# Altium schematic sheet DRV5032AJLPGM.SchDoc
size A; SheetNumber: 13; SheetTotal: 20
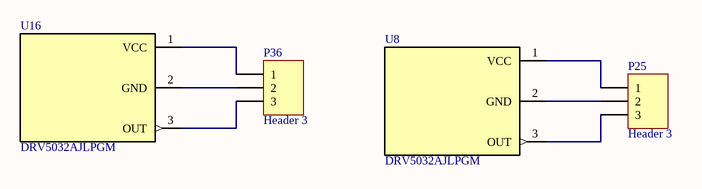
[diagram p0: DRV5032AJLPGM.SchDoc]

## Parts
P25  Header 3  [HDR1X3]
P36  Header 3  [HDR1X3]
U8  DRV5032AJLPGM  [SENSOR_DRV5055A2QLPGM]
U16  DRV5032AJLPGM  [SENSOR_DRV5055A2QLPGM]

## Nets
NetP25_1: P25.1 U8.1(VCC)
NetP25_2: P25.2 U8.2(GND)
NetP25_3: P25.3 U8.3(OUT)
NetP36_1: P36.1 U16.1(VCC)
NetP36_2: P36.2 U16.2(GND)
NetP36_3: P36.3 U16.3(OUT)

## Library data of the parts
P25 P36 = Header 3: Header, 3-Pin; LatestRevisionDate: 17-Jul-2002; LatestRevisionNote: Re-released for DXP Platform.; Publisher: Altium Limited
U8 U16 = DRV5032AJLPGM: Low power (5 Hz, <1ÂµA), low voltage (up to 5.5V) switch; MF: Texas Instruments; Value: *; MP: DRV5032AJLPGM; Package: TO-92-3 Texas Instruments; Check_prices: https://www.snapeda.com/parts/DRV5032AJLPGM/Texas+Instruments/view-part/?ref=eda; Purchase-URL: https://pricing.snapeda.com/search/part/DRV5032AJLPGM/?ref=eda; Price: None; Availability: In Stock; SnapEDA_Link: https://www.snapeda.com/parts/DRV5032AJLPGM/Texas+Instruments/view-part/?ref=snap